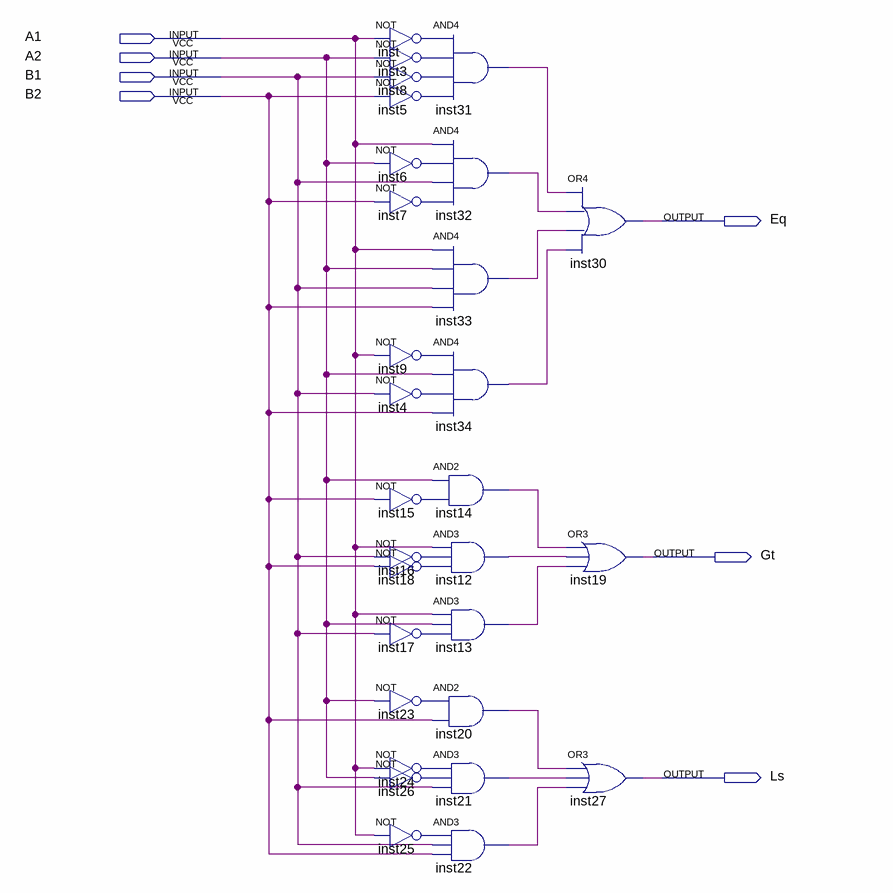
[diagram p0: schematic sheet]
// Quartus schematic week3_1_2.bdf as structural Verilog: 29 symbols, 7 pins
module week3_1_2 (
  input  A1,
  input  A2,
  input  B1,
  input  B2,
  output Eq,
  output Gt,
  output Ls
);

  wire inst3_out, inst4_out, inst5_out, inst6_out, inst7_out, inst8_out, inst9_out, inst12_out, inst13_out,
       inst14_out, inst15_out, inst16_out, inst17_out, inst18_out, inst20_out, inst21_out, inst22_out,
       inst23_out, inst24_out, inst25_out, inst26_out, inst31_out, inst32_out, inst33_out, inst34_out,
       inst_out;

  not inst (inst_out, A1);
  not inst3 (inst3_out, A2);
  not inst8 (inst8_out, B1);
  not inst5 (inst5_out, B2);
  not inst6 (inst6_out, A2);
  not inst7 (inst7_out, B2);
  not inst9 (inst9_out, A1);
  not inst4 (inst4_out, B1);
  not inst15 (inst15_out, B2);
  not inst16 (inst16_out, B1);
  not inst18 (inst18_out, B2);
  not inst17 (inst17_out, B1);
  not inst23 (inst23_out, A2);
  not inst24 (inst24_out, A1);
  not inst26 (inst26_out, A2);
  not inst25 (inst25_out, A1);
  and inst31 (inst31_out, inst_out, inst3_out, inst8_out, inst5_out);
  and inst32 (inst32_out, A1, inst6_out, B1, inst7_out);
  and inst33 (inst33_out, A1, A2, B1, B2);
  and inst34 (inst34_out, inst9_out, A2, inst4_out, B2);
  and inst14 (inst14_out, A2, inst15_out);
  and inst12 (inst12_out, A1, inst16_out, inst18_out);
  and inst13 (inst13_out, A1, A2, inst17_out);
  and inst20 (inst20_out, inst23_out, B2);
  and inst21 (inst21_out, inst24_out, inst26_out, B1);
  and inst22 (inst22_out, inst25_out, B1, B2);
  or inst30 (Eq, inst31_out, inst32_out, inst33_out, inst34_out);
  or inst19 (Gt, inst14_out, inst12_out, inst13_out);
  or inst27 (Ls, inst20_out, inst21_out, inst22_out);
endmodule
